# Altium schematic sheet 03 SENSORS.SchDoc
size 420 x 297 mm
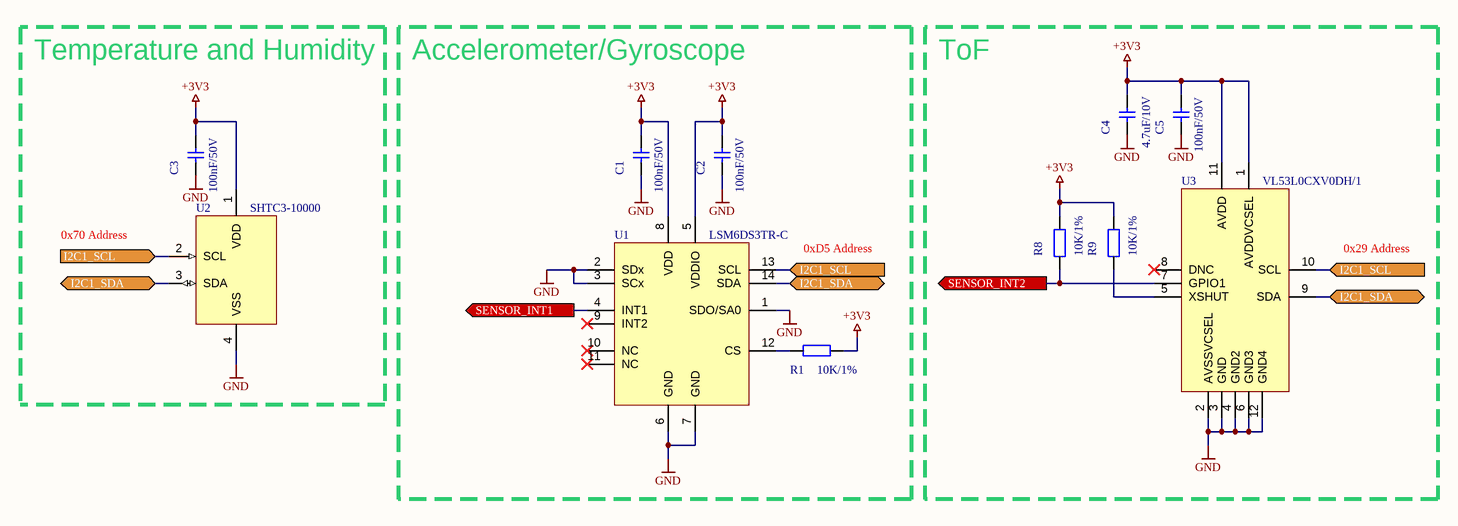
[diagram p0: 03 SENSORS.SchDoc]

## Parts
C1  100nF/50V  [CAPC1005X06N]
C2  100nF/50V  [CAPC1005X06N]
C3  100nF/50V  [CAPC1005X06N]
C4  4.7uF/10V  [CAPC1005X06N]
C5  100nF/50V  [CAPC1005X06N]
R1  10K/1%  [RESC1005X04N]
R8  10K/1%  [RESC1005X04N]
R9  10K/1%  [RESC1005X04N]
U1  LSM6DS3TR-C  [PQFN50P300X250X86-14N]
U2  SHTC3-10000  [SON100P200X75_HS-5N]
U3  VL53L0CXV0DH/1  [VL53L0CXV0DH/1]

## Blocks framed on the sheet
Temperature and Humidity: C3 U2
Accelerometer/Gyroscope: C1 C2 R1 U1
ToF: C4 C5 R8 R9 U3

## Ports
I2C1_SCL (in), I2C1_SDA (bidir), SENSOR_INT1 (out), SENSOR_INT2 (out)

## Nets
+3V3: C1.2 C2.2 C3.2 C4.2 C5.2 R1.1 R8.1 R9.1 U1.5(VDDIO) U1.8(VDD) U2.1(VDD) U3.1(AVDDVCSEL) U3.11(AVDD)
GND: C1.1 C2.1 C3.1 C4.1 C5.1 U1.1(SDO/SA0) U1.2(SDx) U1.3(SCx) U1.6(GND) U1.7(GND) U2.4(VSS) U3.2(AVSSVCSEL) U3.3(GND) U3.4(GND2) U3.6(GND3) U3.12(GND4)
I2C1_SCL: U1.13(SCL) U2.2(SCL) U3.10(SCL) ; port I2C1_SCL
I2C1_SDA: U1.14(SDA) U2.3(SDA) U3.9(SDA) ; port I2C1_SDA
SENSOR_INT1: U1.4(INT1) ; port SENSOR_INT1
SENSOR_INT2: R8.2 U3.7(GPIO1) ; port SENSOR_INT2
NetR1_2: R1.2 U1.12(CS)
NetR9_2: R9.2 U3.5(XSHUT)

Not connected (* = marked no-connect by the designer): U1 9(INT2)* 10(NC)* 11(NC)*; U3 8(DNC)*

## Notes on the sheet
- 0x70 Address
- 0xD5 Address
- 0x29 Address
- Title
- Project
- Size
- Date
- Revision
- A3

## Library data of the parts
C1-C3 C5 = CL05B104KO5NNNC: 16V 100nF X7R ±10% 0402  Multilayer Ceramic Capacitors MLCC - SMD/SMT ROHS; manufacturer: Samsung Electro-Mechanics; assembler_number: C1525; mfr_part_number: CL05B104KO5NNNC; datasheet: https://datasheet.lcsc.com/lcsc/1810191219_Samsung-Electro-Mechanics-CL05B104KO5NNNC_C1525.pdf
C4 = CL05A475MP5NRNC: 10V 4.7uF X5R ±20% 0402  Multilayer Ceramic Capacitors MLCC - SMD/SMT ROHS; manufacturer: Samsung Electro-Mechanics; assembler_number: C23733; mfr_part_number: CL05A475MP5NRNC; datasheet: https://datasheet.lcsc.com/lcsc/1810191211_Samsung-Electro-Mechanics-CL05A475MP5NRNC_C23733.pdf
R1 R8 R9 = 0402WGF1002TCE: 62.5mW Thick Film Resistors 50V ±100ppm/℃ ±1% -55℃~+155℃ 10kΩ 0402  Chip Resistor - Surface Mount ROHS; manufacturer: UNI-ROYAL(Uniroyal Elec); assembler_number: C25744; mfr_part_number: 0402WGF1002TCE; datasheet: https://datasheet.lcsc.com/lcsc/2206010100_UNI-ROYAL-Uniroyal-Elec-0402WGF1002TCE_C25744.pdf
U1 = LSM6DS3TR-C: LGA-14L  Attitude Sensor/Gyroscope ROHS; manufacturer: STMicroelectronics; assembler_number: C967633; mfr_part_number: LSM6DS3TR-C; datasheet: https://datasheet.lcsc.com/lcsc/2102261805_STMicroelectronics-LSM6DS3TR-C_C967633.pdf
U2 = SHTC3-10000: DFN  Temperature and Humidity Sensor ROHS; manufacturer: Sensirion; assembler_number: C2880044; mfr_part_number: SHTC3-10000; datasheet: https://datasheet.lcsc.com/lcsc/2108150430_Sensirion-SHTC3-10000_C2880044.pdf
U3 = VL53L0CXV0DH/1: 4.4*2.4*1.0mm  Position Sensor ROHS; manufacturer: STMicroelectronics; assembler_number: C91199; mfr_part_number: VL53L0CXV0DH/1; datasheet: https://datasheet.lcsc.com/lcsc/1811101103_STMicroelectronics-VL53L0CXV0DH-1_C91199.pdf